# EAGLE design H14RA (EAGLE 9.6.1)

## Sheet 1 of 2
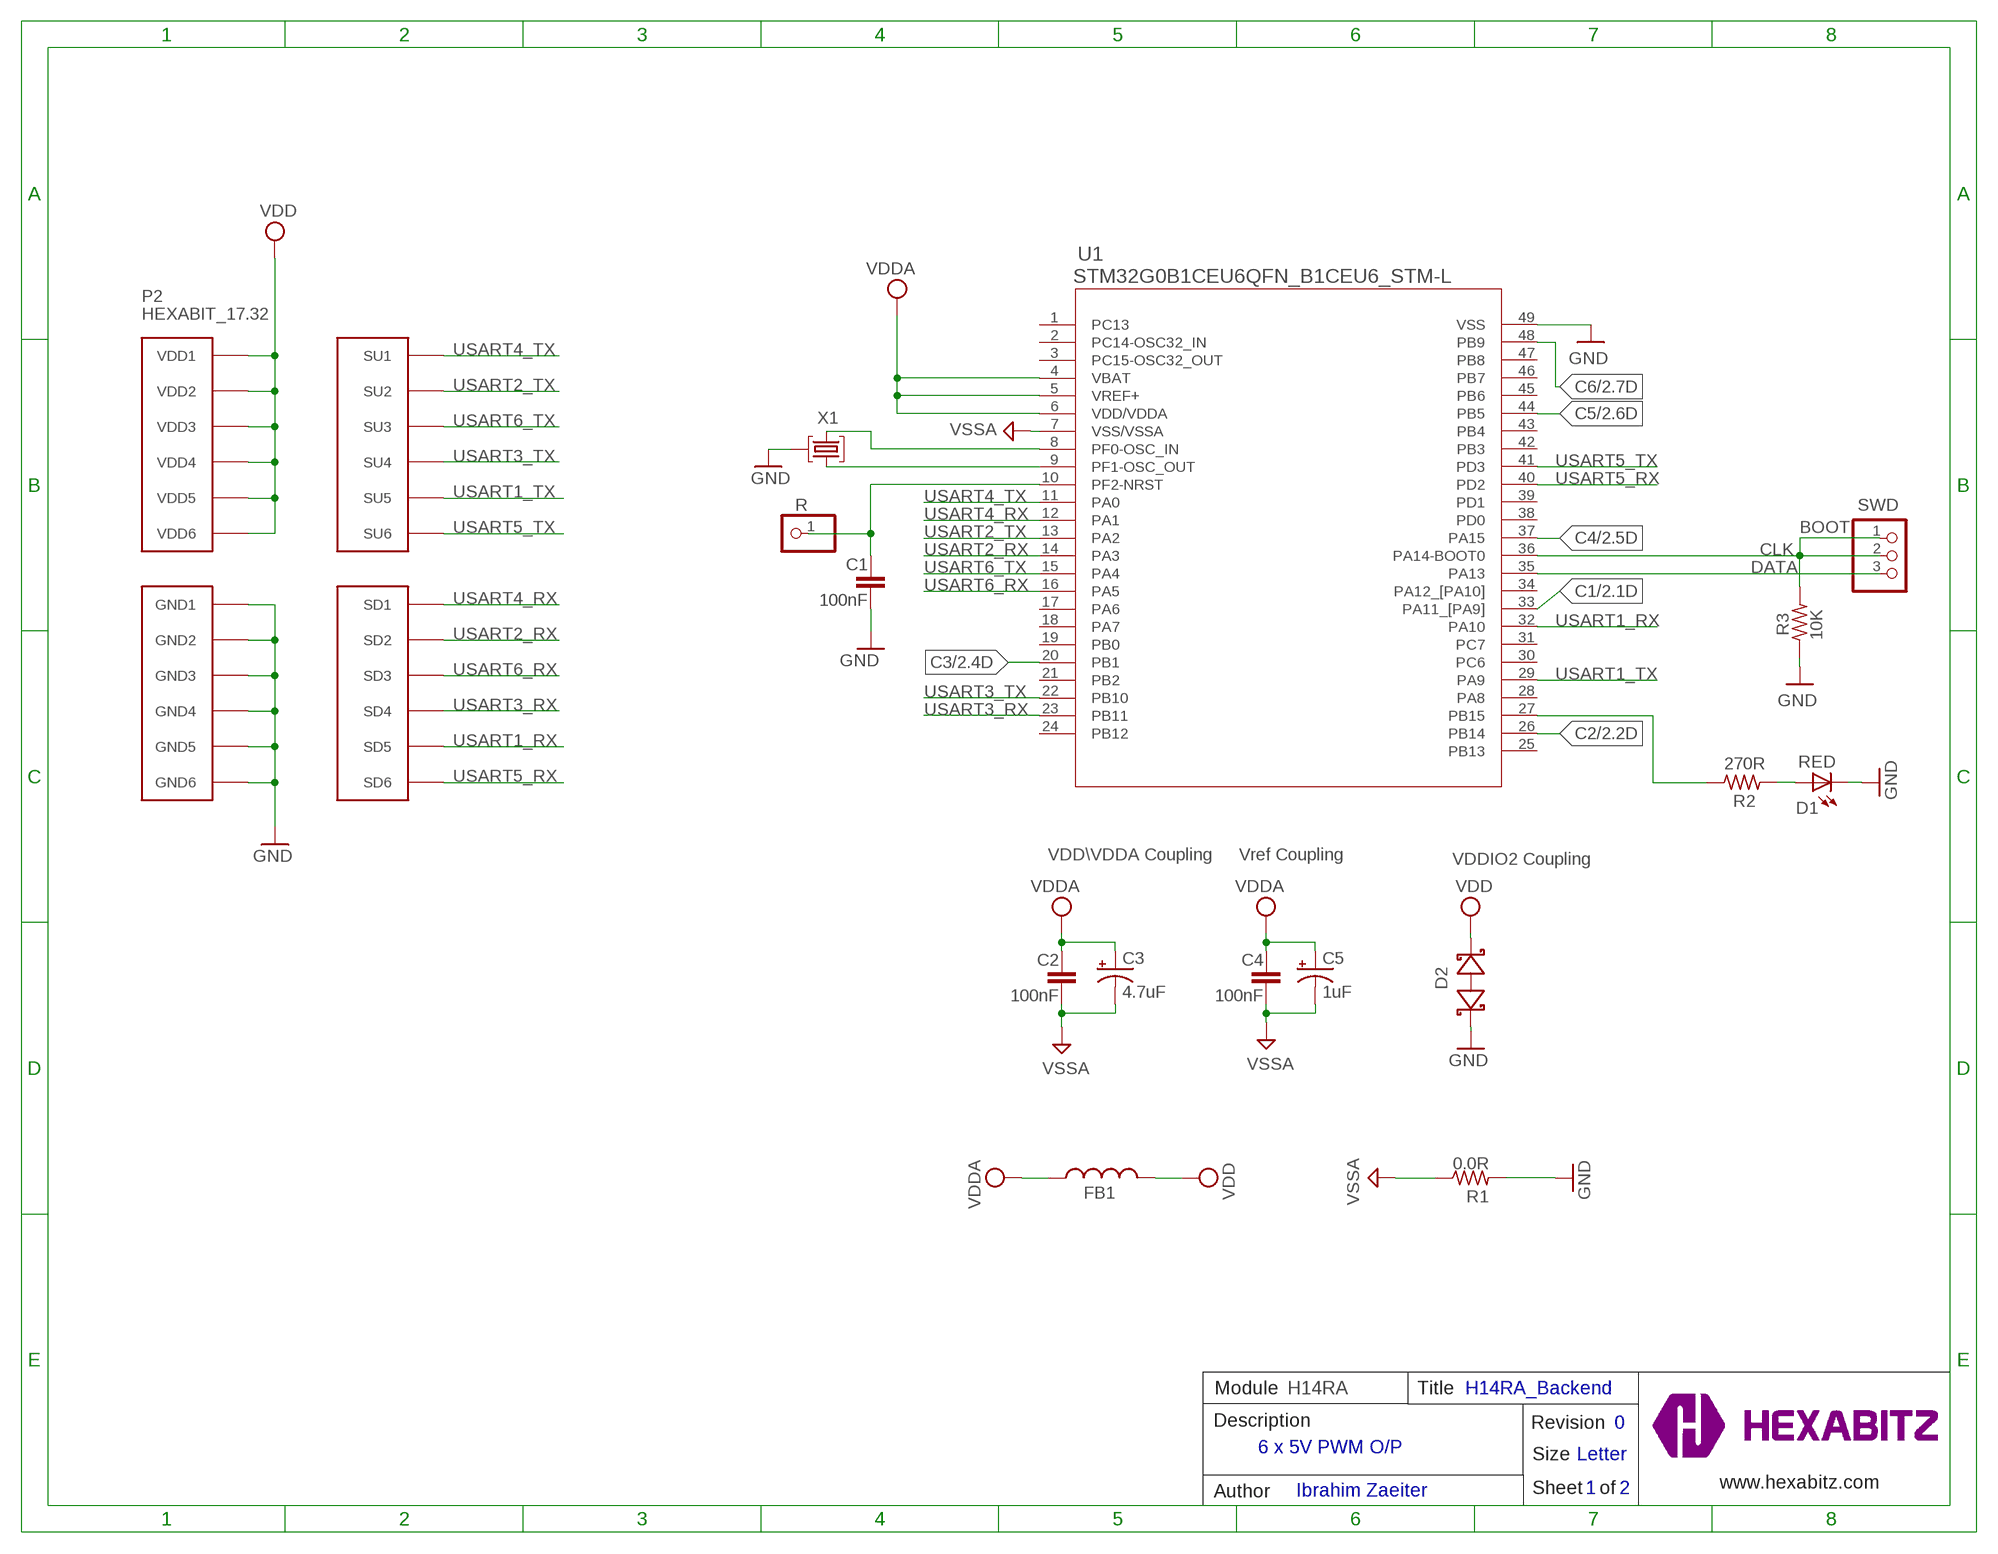
[diagram p0: schematic, sheet 1]

### Parts
C1  100nF  C-0603  [C-0603]
C2  100nF  C-0603  [C-0603]
C3  4.7uF  C-0805-POL  [C-0805-POL]
C4  100nF  C-0603  [C-0603]
C5  1uF  C-0805-POL  [C-0805-POL]
D1  RED  VLMS1300-GS08  [VLMS1300-GS08]
D2  BOURNS_CDSOD323-T03SCBOURNS_CDSOD323-T03SC_0_0  [BOURNS_CDSOD323-T03SC_0]
FB1  FB-0603  [FB-0603]
P2  HEXABIT_17.32  [HEXABIT_17.32]
R  R  PINHD-1X1  [1X01]
R1  0.0R  R-0603  [R-0603]
R2  270R  R-0603  [R-0603]
R3  10K  R-0603  [R-0603]
SWD  PINHD-1X3  [1X03]
TRIMBLE-LOGO2  HEXA-LOGO  [HEXA-LOGO]
U1  STM32G0B1CEU6QFN_B1CEU6_STM-L  [QFN_B1CEU6_STM-L]
X1  XTALL_CSTCE8M00G52  [XTALL_CSTCE8M00G52]

### Nets
C1: U1.33(PA11_[PA9]) ; also sheet 2
C2: U1.26(PB14) ; also sheet 2
C3: U1.20(PB1) ; also sheet 2
C4: U1.37(PA15) ; also sheet 2
C5: U1.44(PB5) ; also sheet 2
C6: U1.48(PB9) ; also sheet 2
CLK: R3.2 SWD.1 SWD.2 U1.36(PA14-BOOT0)
DATA: SWD.3 U1.35(PA13)
GND: C1.2 D1.C D2.1(A) P2.PAD_PD7(GND1) P2.PAD_PD8(GND2) P2.PAD_PD9(GND3) P2.PAD_PD10(GND4) P2.PAD_PD11(GND5) P2.PAD_PD12(GND6) R1.2 R3.1 U1.49(VSS) X1.P$2
N$1: D1.A R2.2
N$2: R2.1 U1.27(PB15)
N$5: U1.9(PF1-OSC_OUT) X1.P$1
N$6: U1.8(PF0-OSC_IN) X1.P$3
N$8: C1.1 R.1 U1.10(PF2-NRST)
USART1_RX: P2.PAD_PD5(SD5) U1.32(PA10)
USART1_TX: P2.PAD_PU5(SU5) U1.29(PA9)
USART2_RX: P2.PAD_PD2(SD2) U1.14(PA3)
USART2_TX: P2.PAD_PU2(SU2) U1.13(PA2)
USART3_RX: P2.PAD_PD4(SD4) U1.23(PB11)
USART3_TX: P2.PAD_PU4(SU4) U1.22(PB10)
USART4_RX: P2.PAD_PD1(SD1) U1.12(PA1)
USART4_TX: P2.PAD_PU1(SU1) U1.11(PA0)
USART5_RX: P2.PAD_PD6(SD6) U1.40(PD2)
USART5_TX: P2.PAD_PU6(SU6) U1.41(PD3)
USART6_RX: P2.PAD_PD3(SD3) U1.16(PA5)
USART6_TX: P2.PAD_PU3(SU3) U1.15(PA4)
VDD: D2.2(C) FB1.2 P2.PAD_PU7(VDD1) P2.PAD_PU8(VDD2) P2.PAD_PU9(VDD3) P2.PAD_PU10(VDD4) P2.PAD_PU11(VDD5) P2.PAD_PU12(VDD6)
VDDA: C2.1 C3.1(+) C4.1 C5.1(+) FB1.1 U1.4(VBAT) U1.5(VREF+) U1.6(VDD/VDDA) ; also sheet 2
VSSA: C2.2 C3.2(-) C4.2 C5.2(-) R1.1 U1.7(VSS/VSSA) ; also sheet 2
Unconnected: U1.1(PC13) U1.2(PC14-OSC32_IN) U1.3(PC15-OSC32_OUT) U1.17(PA6) U1.18(PA7) U1.19(PB0) U1.21(PB2) U1.24(PB12) U1.25(PB13) U1.28(PA8) U1.30(PC6) U1.31(PC7) U1.34(PA12_[PA10]) U1.38(PD0) U1.39(PD1) U1.42(PB3) U1.43(PB4) U1.45(PB6) U1.46(PB7) U1.47(PB8)

### Notes on the sheet
- BOOT
- VDD\VDDA Coupling | Vref Coupling | VDDIO2 Coupling
- Module | H14RA | Title | H14RA_Backend
- Description | Revision | 0
- 6 x 5V PWM O/P
- Size | Letter
- www.hexabitz.com
- Author | Ibrahim Zaeiter | Sheet   of | 1 | 2
- C:/Users/Admin/Desktop/logodraft.bmp

## Sheet 2 of 2
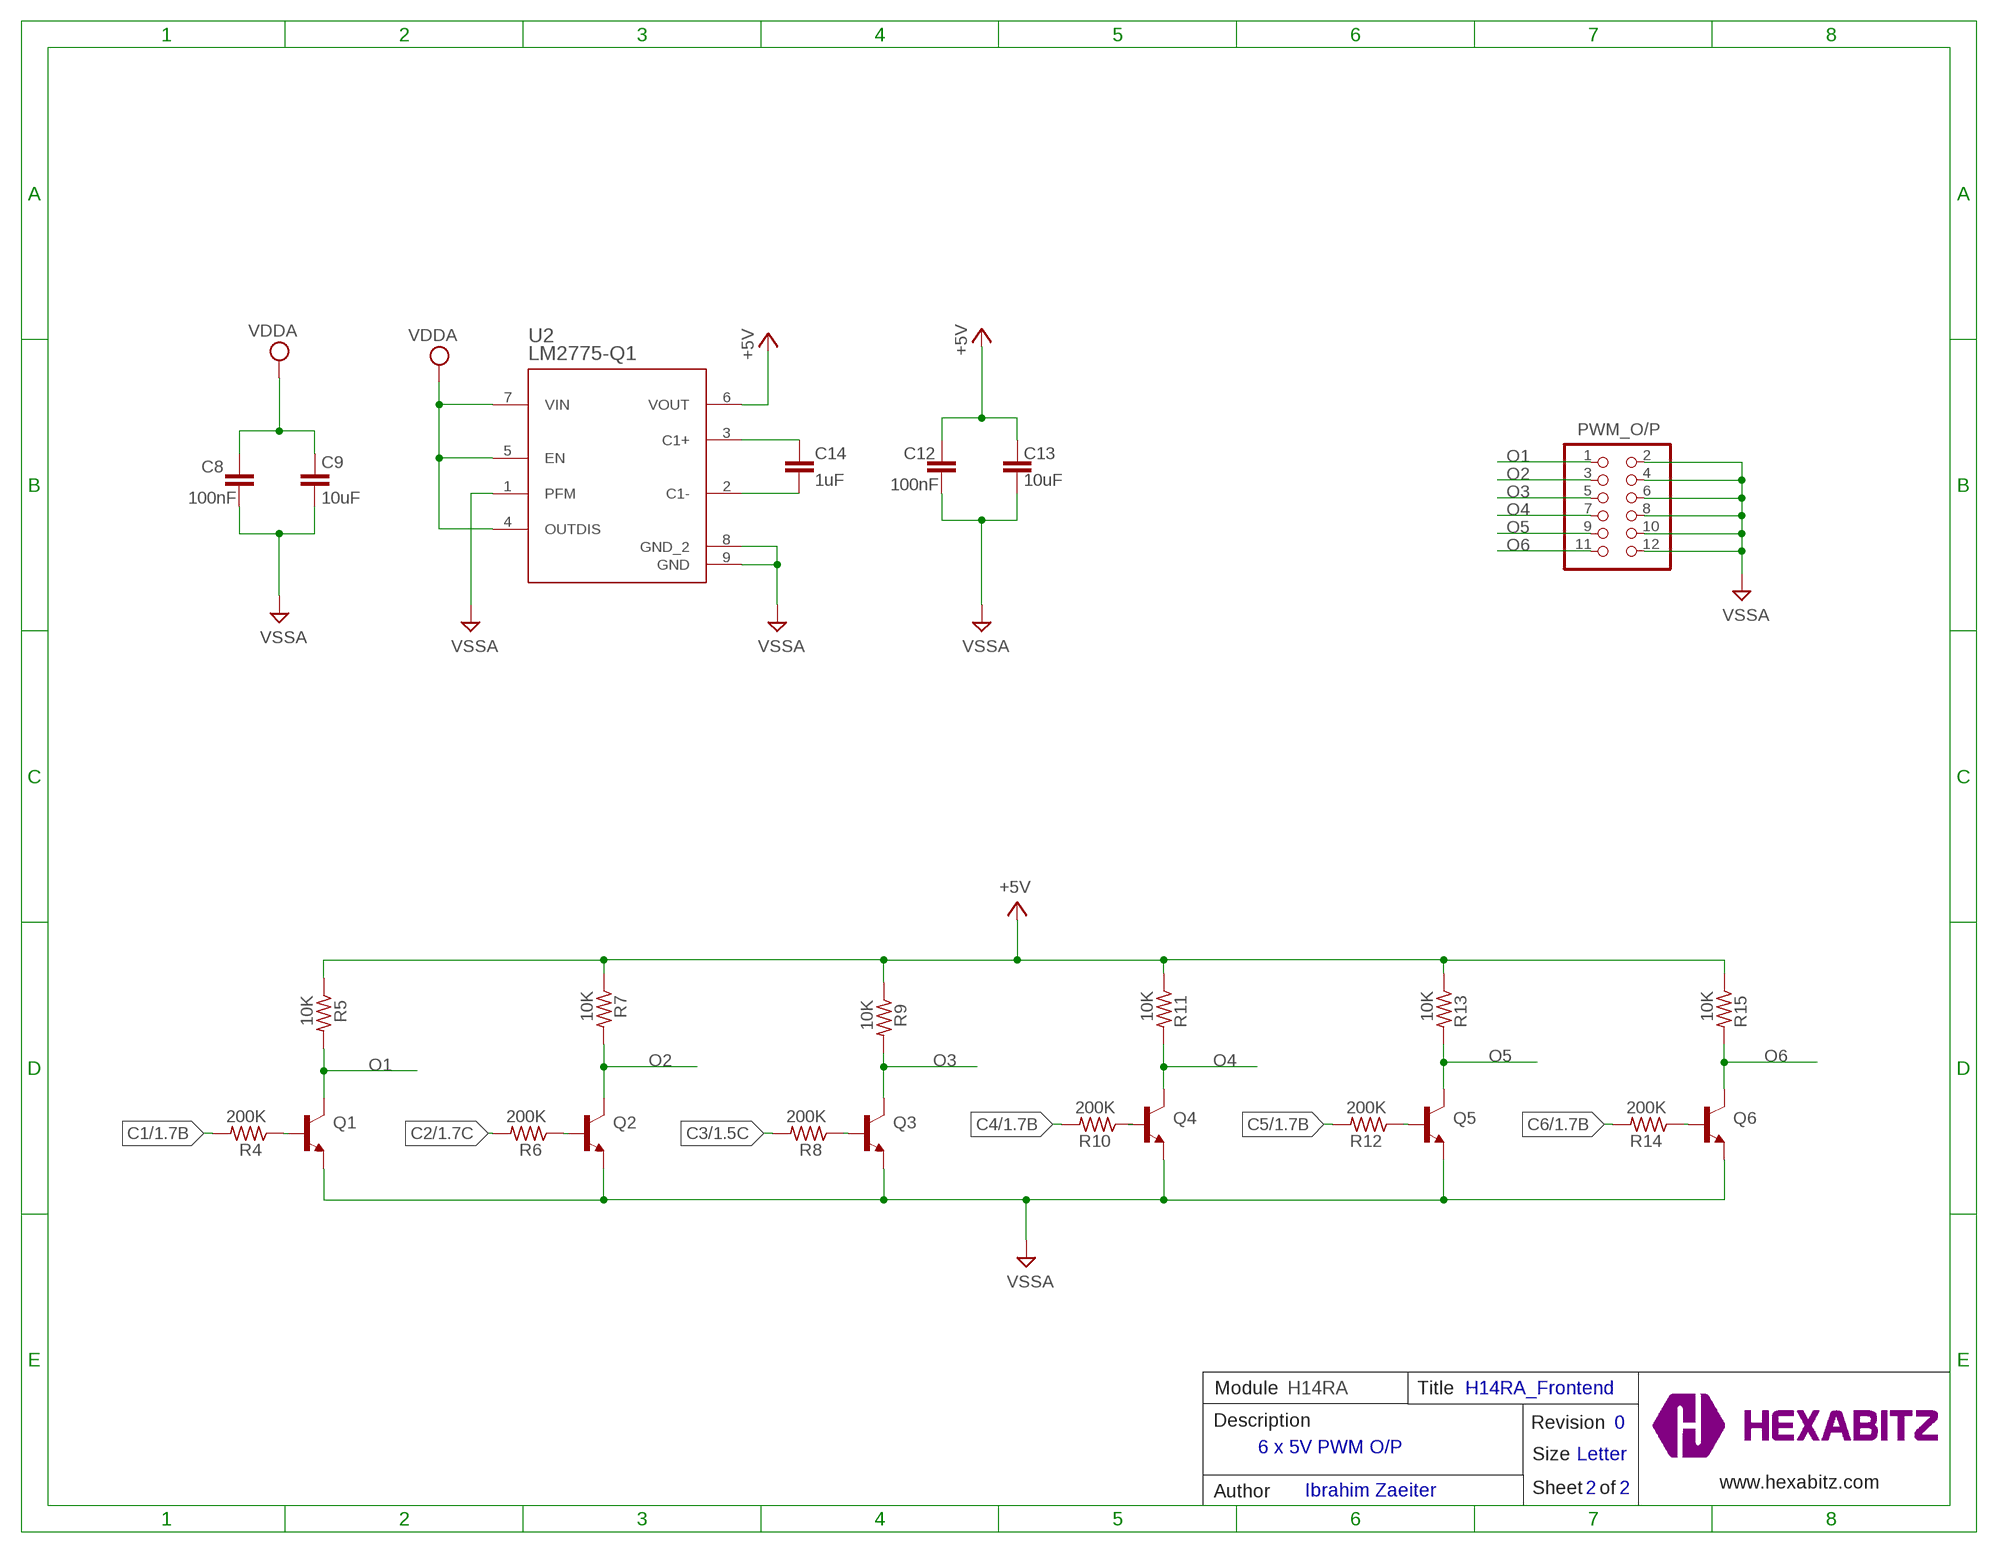
[diagram p1: schematic, sheet 2]

### Parts
C8  100nF  C-0603  [C-0603]
C9  10uF  C-0603  [C-0603]
C12  100nF  C-0603  [C-0603]
C13  10uF  C-0603  [C-0603]
C14  1uF  C-0805  [C-0805]
PWM_O/P  PINHD-2X6  [2X06]
Q1  MMBT3904LT1  [MMBT3904LT1]
Q2  MMBT3904LT1  [MMBT3904LT1]
Q3  MMBT3904LT1  [MMBT3904LT1]
Q4  MMBT3904LT1  [MMBT3904LT1]
Q5  MMBT3904LT1  [MMBT3904LT1]
Q6  MMBT3904LT1  [MMBT3904LT1]
R4  200K  R-0603  [R-0603]
R5  10K  R-0603  [R-0603]
R6  200K  R-0603  [R-0603]
R7  10K  R-0603  [R-0603]
R8  200K  R-0603  [R-0603]
R9  10K  R-0603  [R-0603]
R10  200K  R-0603  [R-0603]
R11  10K  R-0603  [R-0603]
R12  200K  R-0603  [R-0603]
R13  10K  R-0603  [R-0603]
R14  200K  R-0603  [R-0603]
R15  10K  R-0603  [R-0603]
U2  LM2775-Q1  LM2775QDSGRQ1  [DSG0008A]

### Nets
+5V: C12.1 C13.1 R5.1 R7.1 R9.1 R11.1 R13.1 R15.1 U2.6(VOUT)
C1: R4.2 ; also sheet 1
C2: R6.2 ; also sheet 1
C3: R8.2 ; also sheet 1
C4: R10.2 ; also sheet 1
C5: R12.2 ; also sheet 1
C6: R14.2 ; also sheet 1
N$3: C14.2 U2.2(C1-)
N$4: C14.1 U2.3(C1+)
N$12: Q5.1(B) R12.1
N$14: Q4.1(B) R10.1
N$15: Q6.1(B) R14.1
N$16: Q2.1(B) R6.1
N$18: Q1.1(B) R4.1
N$20: Q3.1(B) R8.1
O1: PWM_O/P.1 Q1.3(C) R5.2
O2: PWM_O/P.3 Q2.3(C) R7.2
O3: PWM_O/P.5 Q3.3(C) R9.2
O4: PWM_O/P.7 Q4.3(C) R11.2
O5: PWM_O/P.9 Q5.3(C) R13.2
O6: PWM_O/P.11 Q6.3(C) R15.2
VDDA: C8.1 C9.1 U2.4(OUTDIS) U2.5(EN) U2.7(VIN) ; also sheet 1
VSSA: C8.2 C9.2 C12.2 C13.2 PWM_O/P.2 PWM_O/P.4 PWM_O/P.6 PWM_O/P.8 PWM_O/P.10 PWM_O/P.12 Q1.2(E) Q2.2(E) Q3.2(E) Q4.2(E) Q5.2(E) Q6.2(E) U2.1(PFM) U2.8(GND_2) U2.9(GND) ; also sheet 1

### Notes on the sheet
- Module | H14RA | Title | H14RA_Frontend
- Description | Revision | 0
- 6 x 5V PWM O/P
- Size | Letter
- www.hexabitz.com
- Author | Ibrahim Zaeiter | Sheet   of | 2 | 2
- C:/Users/Admin/Desktop/logodraft.bmp

## Library data of the parts
C1 C2 C4 C8 C9 C12 C13 = HEXABITZ_RCLS:C-0603: CAP CER 10% X7R 0603
C3 C5 = HEXABITZ_RCLS:C-0805-POL: Cap Tant Solid SMD 2012
C14 = HEXABITZ_RCLS:C-0805: CAP CER 10% X7R 0805
D1 = Hexabitz:VLMS1300-GS08: Red 0603 130° Clear 54 mcd 2 V Surface Mount ChipLED ; Octopart Url : http://octopart.com/vlms1300-gs08-vishay-21709201; MFN: Vishay; MPN: VLMS1300-GS08; OCTOPART_URL: https://octopart.com/vlms1300-gs08-vishay-21709201?r=sp&s=_gcP4_q8T1SC6PJQPTQ9yA
D2 = HEXABITZ_RCLS:BOURNS_CDSOD323-T03SC: CDSOD323-TxxSC - TVS Diode Series; DESCRIPTION: Dio Tvs Vwm 03V 500W Bidir Sod323 / Tape & Reel - 7" Reel; MFN: Bourns; MPN: CDSOD323-T03SC; OCTOPART_URL: https://octopart.com/cdsod323-t03sc-bourns-10487153?r=sp
FB1 = HEXABITZ_RCLS:FB-0603: Ferrite Beads Multi-Layer 0603
P2 = hexabitz_connectors:HEXABIT_?: Hexabitz Hexagon Module Connector Hexagon side length = 28.87mm.
PWM_O/P = pinhead:PINHD-2X6: PIN HEADER
Q1-Q6 = HEXABITZ_RCLS:MMBT3904LT1: TRANS NPN 40V 0.2A SOT23; MOUNTING_STYLE: Surface Mount; NUM_OF_PINS: 3; PACKAGE: SOT-23-3; PACKAGING: Reel; PRODUCT_CATEGORY: Transistors Bipolar-BJT; SERIES: MMBT3904L
R = HEXABITZ_USER_INTERFACE_PARTS:PINHD-1X1: PIN HEADER; MFN: TE Connectivity; MPN: 87227-1; OCTOPART_URL: https://octopart.com/87227-1-te+connectivity-39512052?r=sp
R1-R15 = HEXABITZ_RCLS:R-0603: Thick Film Resistors - SMD 0603
SWD = pinhead:PINHD-1X3: PIN HEADER
TRIMBLE-LOGO2 = HEXABITZ_USER_INTERFACE_PARTS:HEXA-LOGO: Trimble-Logo
U1 = HEXABITZ_ICs:STM32G0B1CEU6; COPYRIGHT: Copyright (C) 2021 Ultra Librarian. All rights reserved.; MANUFACTURER_PART_NUMBER: STM32G0B1CEU6; MFR_NAME: STMicroelectronics
U2 = HEXABITZ_ICs:LM2775QDSGRQ1: Switched Capacitor 5V Boost Converter 8-WSON -40 to 125; MANUFACTURER: Texas Instruments; MFN: Texas Instruments; MPN: LM2775QDSGRQ1; OCTOPART_URL: https://octopart.com/lm2775qdsgrq1-texas+instruments-93339195?r=sp&s=OA7oim0HQqaBsU4tLKFWXg LM2775QDSGRQ1; PARTNUMBER: LM2775QDSGRQ1; REFDES: RefDes; TYPE: TYPE
X1 = Hexabitz:XTALL_CSTCE8M00G52: MURATA CSTCE8M00G52-R0 RESONATOR, SMD, 8MHZ ; Octopart Url : https://octopart.com/cstce8m00g52-r0-murata-7145559; MFN: Murata; MPN: CSTCE8M00G52Z-R0; OCTOPART_URL: https://octopart.com/cstce8m00g52z-r0-murata-17755941?r=sp&s=JDnNJnrHQhyS8Zk4ofFWXw

## Board
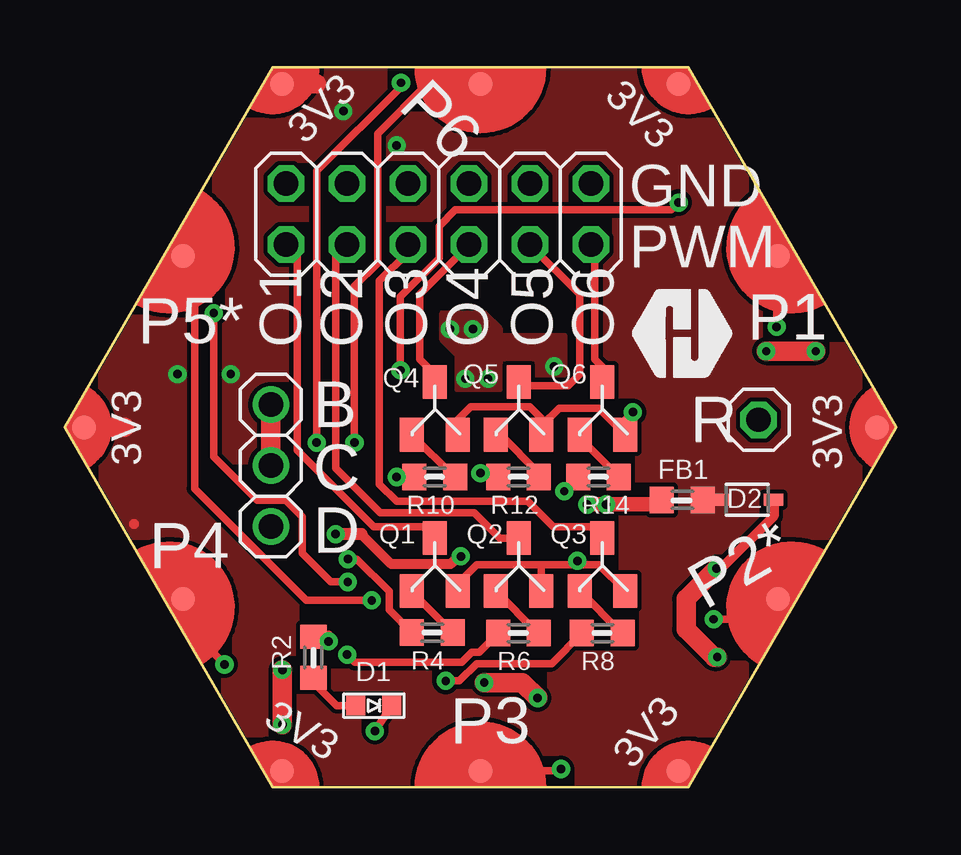
[diagram p2: board, top side]
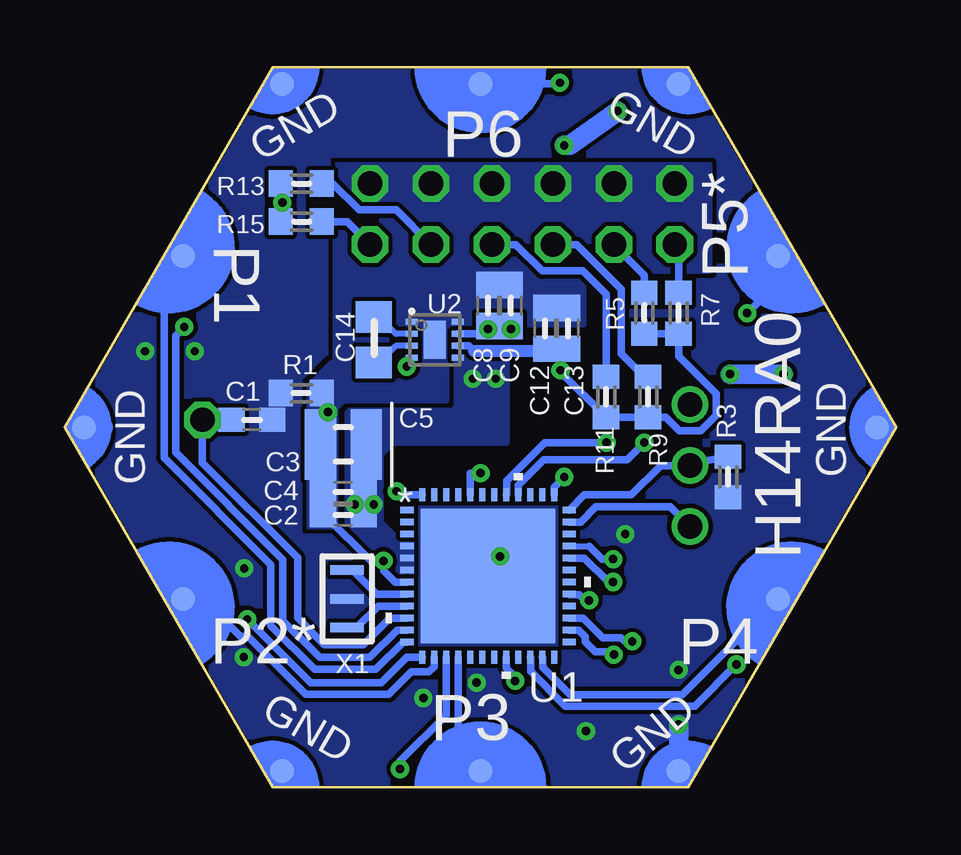
[diagram p3: board, bottom side, seen from below]

Size 34.64 x 30 mm. Coordinates in mm from the lower left corner, seen from the top.
Copper layers (1*16): Top 0.035mm / dielectric 1.5mm / Bottom 0.035mm
Design rules "default *": minimum track width 6mil, minimum drill 0.35mm, track to track 7mil, track to pad 7mil, pad to pad 7mil, via to via 7mil, smd to smd 0mil, copper to edge 1mil, drill to drill 6mil, minimum pad ring 10mil, minimum via ring 8mil, stop-mask expansion 4mil, vias tented up to drill 24mil, thermal gap 10mil

### Footprints (pad centres in the part's own frame; a part is rotated, then mirrored left to right if it is on the bottom)
C-0603 = smd 1.1 x 1: 1 -0.85,0; 2 0.85,0
C-0805-POL = smd 1.3 x 1.5: 1 -0.95,0; 2 0.95,0
C-0805 = smd 1.3 x 1.5: 1 -0.95,0; 2 0.95,0
VLMS1300-GS08 = smd 0.8 x 0.8: A 0,0.75; C 0,-0.75
BOURNS_CDSOD323-T03SC_0 = smd 0.8 x 0.5: 1 -1.1,0; 2 1.1,0
FB-0603 = smd 1 x 1.1: 1 -0.85,0; 2 0.85,0
HEXABIT_17.32 = smd 1 x 1 bottom: PAD_PD1 12.39,7.15; PAD_PD2 12.39,-7.15; PAD_PD3 0,-14.31; PAD_PD4 -12.39,-7.15; PAD_PD5 -12.39,7.15; PAD_PD6 0,14.31; PAD_PD7 8.26,14.31; PAD_PD8 16.52,0; PAD_PD9 8.26,-14.31; PAD_PD10 -8.26,-14.31; PAD_PD11 -16.52,0; PAD_PD12 -8.26,14.31 | smd 1 x 1: PAD_PU1 12.39,7.15; PAD_PU2 12.39,-7.15; PAD_PU3 0,-14.31; PAD_PU4 -12.39,-7.15; PAD_PU5 -12.39,7.15; PAD_PU6 0,14.31; PAD_PU7 8.26,14.31; PAD_PU8 16.52,0; PAD_PU9 8.26,-14.31; PAD_PU10 -8.26,-14.31; PAD_PU11 -16.52,0; PAD_PU12 -8.26,14.31
2X06 = drill 1.016 octagon: 1 -6.35,-1.27; 2 -6.35,1.27; 3 -3.81,-1.27; 4 -3.81,1.27; 5 -1.27,-1.27; 6 -1.27,1.27; 7 1.27,-1.27; 8 1.27,1.27; 9 3.81,-1.27; 10 3.81,1.27; 11 6.35,-1.27; 12 6.35,1.27
MMBT3904LT1 = smd 1 x 1.4: 1 -0.95,-1.1; 2 0.95,-1.1; 3 0,1.1
1X01 = drill 1.016 octagon: 1 0,0
R-0603 = smd 1 x 1.1: 1 -0.85,0; 2 0.85,0
1X03 = drill 1.016: 1 -2.54,0; 2 0,0; 3 2.54,0
QFN_B1CEU6_STM-L = smd 0.55 x 0.254: 1 -3.38,2.751; 2 -3.38,2.251; 3 -3.38,1.75; 4 -3.38,1.25; 5 -3.38,0.75; 6 -3.38,0.25; 7 -3.38,-0.25; 8 -3.38,-0.75; 9 -3.38,-1.25; 10 -3.38,-1.75; 11 -3.38,-2.251; 12 -3.38,-2.751; 25 3.38,-2.751; 26 3.38,-2.251; 27 3.38,-1.75; 28 3.38,-1.25; 29 3.38,-0.75; 30 3.38,-0.25; 31 3.38,0.25; 32 3.38,0.75; 33 3.38,1.25; 34 3.38,1.75; 35 3.38,2.251; 36 3.38,2.751 | smd 0.254 x 0.55: 13 -2.751,-3.38; 14 -2.251,-3.38; 15 -1.75,-3.38; 16 -1.25,-3.38; 17 -0.75,-3.38; 18 -0.25,-3.38; 19 0.25,-3.38; 20 0.75,-3.38; 21 1.25,-3.38; 22 1.75,-3.38; 23 2.251,-3.38; 24 2.751,-3.38; 37 2.751,3.38; 38 2.251,3.38; 39 1.75,3.38; 40 1.25,3.38; 41 0.75,3.38; 42 0.25,3.38; 43 -0.25,3.38; 44 -0.75,3.38; 45 -1.25,3.38; 46 -1.75,3.38; 47 -2.251,3.38; 48 -2.751,3.38 | smd 5.6 x 5.6: 49 0,0
DSG0008A = smd 0.5 x 0.25: 1 -0.95,0.75; 2 -0.95,0.25; 3 -0.95,-0.25; 4 -0.95,-0.75; 5 0.95,-0.75; 6 0.95,-0.25; 7 0.95,0.25; 8 0.95,0.75 | smd 0.9 x 1.6: 9 0,0
XTALL_CSTCE8M00G52 = smd 1.4 x 0.4: P$1 0,1.2; P$2 0,0; P$3 0,-1.2

### Placement (x,y rotation side)
C1  26.84,15.32 0 bottom
C2  23.04,11.35 180 bottom
C3  23.04,13.57 180 bottom
C4  23.04,12.3 180 bottom
C5  23.04,15 180 bottom
C8  17,20.08 90 bottom
C9  16.05,20.08 90 bottom
C12  14.62,19.13 90 bottom
C13  13.67,19.13 90 bottom
C14  21.77,18.65 90 bottom
D1  12.88,3.41 90 top
D2  28.43,11.98 180 top
FB1  25.73,11.98 0 top
P2  17.32,15 0 top
PWM_O/P  15.57,23.89 0 top
Q1  15.42,9.29 0 top
Q2  18.91,9.29 0 top
Q3  22.4,9.29 0 top
Q4  15.42,15.79 0 top
Q5  18.91,15.79 0 top
Q6  22.4,15.79 0 top
R  28.91,15.32 90 top
R1  24.78,16.43 180 bottom
R2  10.36,5.42 270 top
R3  7,12.94 90 bottom
R4  15.31,6.45 180 top
R5  9.06,19.76 90 bottom
R6  18.91,6.43 180 top
R7  10.49,19.76 90 bottom
R8  22.4,6.43 180 top
R9  10.34,16.27 90 bottom
R10  15.42,12.94 180 top
R11  12.08,16.27 90 bottom
R12  18.91,12.94 180 top
R13  24.78,25.16 0 bottom
R14  22.24,12.94 180 top
R15  24.78,23.57 0 bottom
SWD  8.59,13.41 270 top
TRIMBLE-LOGO2  25.73,17.06 0 top
U1  17,8.81 0 bottom
U2  19.23,18.65 0 bottom
X1  22.88,7.86 180 bottom

### Tracks (layer width: path | path; a pad name or v marks a point on that pad's centre or on a via)
+5V  (via drill 0.35)
  Top 0.305: v13.99,17.38 13.99,20.44 15.59,22.05 15.59,23.39 16.27,24.07 25.28,24.07 v25.58,24.37
  Bottom 0.254: C12.1 14.14,18.28 C13.1
  Bottom 0.305: R13.1 25.58,25.1 v25.58,24.37 25.63,24.31 R15.1 | R7.1 R5.1 9.06,17.97 7.5,16.4 7.5,15.5 8.14,14.86 9.04,14.86 9.6,15.42 R9.1 R11.1 13.99,17.32 v13.99,17.38 13.99,18.12 14.14,18.28 | U2.6 17.8,18.4 17.59,18.19 | C12.1 14.71,18.19
  Bottom 0.508: 17.59,18.19 14.71,18.19
C1  (via drill 0.35)
  Top 0.305: v11.79,9.51 12.17,9.51 13.51,8.17 13.51,7.4 R4.2
  Bottom 0.254: U1.33 12.79,10.06
  Bottom 0.305: v11.79,9.51 12.24,9.51 12.79,10.06
C2  (via drill 0.35)
  Top 0.305: v11.76,5.53 12.08,5.21 16.54,5.21 16.96,5.64 17.27,5.64 R6.2
  Bottom 0.305: v11.76,5.53 11.89,5.66 12.54,5.66 12.96,6.08 12.96,6.28 13.23,6.56 U1.26
C3  (via drill 0.35)
  Top 0.305: v15.88,4.44 16.44,4.44 17.16,5.16 20.28,5.16 R8.2
  Bottom 0.305: U1.20 16.25,4.97 15.88,4.6 v15.88,4.44
C4  (via drill 0.35)
  Top 0.305: v13.83,12.94 R10.2
  Bottom 0.305: U1.37 14.25,12.51 v13.83,12.94
C5  (via drill 0.35)
  Top 0.305: v17.32,13.09 17.9,13.09 R12.2
  Bottom 0.305: v17.32,13.09 17.75,13.09 U1.44
C6  (via drill 0.35)
  Top 0.305: v20.81,12.34 20.81,12.36 R14.2
  Bottom 0.305: v20.81,12.34 20.66,12.19 U1.48
CLK
  Top 0.813: SWD.1 SWD.2
  Bottom 0.305: U1.36 12.99,12.19 11.03,12.19 9.81,13.41 SWD.2 8.49,13.51 R3.2
DATA
  Bottom 0.305: SWD.3 9.41,11.69 12.51,11.69 13.15,11.06 U1.35
GND  (via drill 0.35, 0.35 pad 0.75)
  Top 0.305: D1.C 13.67,3.46 v12.92,2.35
  Top 0.406: D2.1 29.53,11.3 27.35,9.13 v27.16,9.13 | v16.5,9.63 16.4,9.63 16.07,9.3 13.61,9.3 12.36,10.55
  Top 0.508: 12.36,10.55 v11.29,10.55
  Top 0.813: v19.7,3.73 19.07,4.36 v17.48,4.36 | v9.06,4.9 v9.06,2.62 | v27.16,9.13 25.89,7.86 25.89,6.59 27.05,5.43 v27.18,5.43 | v29.23,18.17 v31.29,18.17
  Bottom 0.406: U1.49 16.5,9.31 v16.5,9.63
  Bottom 0.813: 33.67,15.72 33.84,15.42 P2.PAD_PD8 33.04,15 | v9.06,2.62 P2.PAD_PD10 | 0.8,14.58 P2.PAD_PD11 0.8,15.42
  pour Bottom (rank 3, no thermals): 0.02,15 8.59,29.92 25.73,29.92 34.62,15.32 26.05,0.08 8.75,0.08
N$1
  Top 0.305: R2.2 10.36,4.38 11.33,3.41 D1.A
N$2  (via drill 0.35)
  Top 0.305: R2.1 11,6.38 v11,6.08
  Bottom 0.305: v11,6.08 11.32,6.08 11.47,6.24 12.23,6.24 13.03,7.04 13.61,7.04 U1.27
N$3
  Bottom 0.152: C14.2 21.66,19.5 21.45,19.5
  Bottom 0.254: U2.2 20.85,18.9 21.45,19.5
N$4
  Bottom 0.152: C14.1 21.55,17.7 21.45,17.8
  Bottom 0.254: U2.3 20.85,18.4 21.45,17.8
N$5
  Bottom 0.305: U1.9 21.59,7.56 22.49,6.66 X1.P$1
N$6
  Bottom 0.305: U1.8 21.65,8.06 22.65,9.06 X1.P$3
N$8
  Bottom 0.305: U1.10 21.11,7.06 22.21,5.95 23.83,5.95 24.94,7.06 24.94,9.57 28.91,13.54 R.1 C1.1
N$12
  Top 0.305: Q5.1 18.16,14.69 19.76,13.09 R12.1
N$14
  Top 0.305: Q4.1 16.22,12.94 R10.1
N$15
  Top 0.305: Q6.1 21.45,14.58 R14.1
N$16
  Top 0.305: R6.1 19.71,6.43 Q2.1
N$18
  Top 0.305: R4.1 14.46,8.15 Q1.1
N$20
  Top 0.305: R8.1 23.21,6.43 Q3.1
O1
  Top 0.305: Q1.3 14.94,10.86 12.88,10.86 9.68,14.06 9.68,22.16 PWM_O/P.1
  Bottom 0.305: R5.2 9.06,22.46 PWM_O/P.1
O2
  Top 0.305: Q2.3 18.11,10.38 17.06,11.43 13.15,11.43 11.29,13.3 11.29,22.14 PWM_O/P.3
  Bottom 0.305: PWM_O/P.3 10.49,21.35 R7.2
O3
  Top 0.305: Q3.3 21.92,10.86 20.35,10.86 19.29,11.92 13.83,11.92 13.1,12.64 13.1,21.1 14.3,22.3 PWM_O/P.5
  Bottom 0.305: R9.2 10.49,17.12 11.45,18.07 11.45,20.76 13.31,22.62 PWM_O/P.5
O4
  Top 0.305: Q4.3 15.42,17.21 14.78,17.85 14.78,20.56 PWM_O/P.7
  Bottom 0.305: R11.2 12.08,20.56 13.05,21.53 14.76,21.53 15.85,22.62 PWM_O/P.7
O5
  Top 0.305: Q5.3 19.07,16.73 20.97,16.73 21.45,17.21 21.45,20.56 PWM_O/P.9
  Bottom 0.305: R13.2 23.47,25.16 22.38,24.07 20.83,24.07 PWM_O/P.9
O6
  Top 0.305: Q6.3 22.4,17.53 22.08,17.85 22.08,22.46 PWM_O/P.11
  Bottom 0.305: R15.2 22.88,23.57 PWM_O/P.11
USART1_RX  (via drill 0.35)
  Top 0.305: v6.21,19.76 6.21,13.77 8.02,11.96 9.2,11.96 9.89,11.28 9.89,9.75 11.08,8.56 v11.79,8.56
  Bottom 0.305: v11.79,8.56 11.79,8.61 12.04,8.61 12.99,9.56 U1.32 | v6.21,19.76 4.93,21.04 P2.PAD_PD5
USART1_TX  (via drill 0.35)
  Top 0.305: P2.PAD_PU5 5.41,21.67 5.41,12.45 10.06,7.79 v12.79,7.79
  Bottom 0.305: U1.29 13.6,8.04 13.21,8.04 12.96,7.79 v12.79,7.79
USART2_RX
  Bottom 0.305: P2.PAD_PD2 28.88,7.85 27.33,6.3 27.01,6.3 24.6,3.88 21.14,3.88 20.19,4.82 19.47,4.82 19.25,5.04 U1.14
USART2_TX  (via drill 0.35)
  Top 0.305: P2.PAD_PU2 28.87,7.01 v27.04,7.01
  Bottom 0.305: v27.04,7.01 24.4,4.36 21.45,4.36 20.38,5.43 U1.13
USART3_RX
  Bottom 0.305: U1.23 14.73,5.41 14.73,5.02 13.59,3.87 8.91,3.87 P2.PAD_PD4
USART3_TX  (via drill 0.35)
  Top 0.305: v6.66,5.12 5.02,6.75 4.93,6.92 P2.PAD_PU4
  Bottom 0.305: v6.66,5.12 8.39,3.39 13.79,3.39 15.23,4.84 15.23,5.41 U1.22
USART4_RX
  Bottom 0.305: U1.12 20.54,6.06 21.68,4.92 24.23,4.92 26.05,6.74 26.05,9.28 30.5,13.74 30.5,21.36 P2.PAD_PD1
USART4_TX  (via drill 0.35)
  Top 0.305: P2.PAD_PU1 29.71,20.03 29.66,19.98 v29.66,19.19
  Bottom 0.305: v29.66,19.19 30.02,18.83 30.02,13.96 25.55,9.49 25.55,6.95 24.02,5.42 21.93,5.42 20.79,6.56 U1.11
USART5_RX  (via drill 0.35)
  Top 0.305: v10.49,14.36 10.49,25.69 14.01,29.2 v14.01,29.36
  Bottom 0.305: U1.40 15.75,12.58 14.69,13.64 11.21,13.64 v10.49,14.36 | P2.PAD_PD6 14.06,29.31 v14.01,29.36
USART5_TX  (via drill 0.35)
  Top 0.305: v12.07,14.36 12.07,20.87 13.03,21.84 13.03,27.25 15.1,29.31 P2.PAD_PU6
  Bottom 0.305: U1.41 16.23,12.21 16.23,12.78 14.65,14.36 v12.07,14.36
USART6_RX
  Bottom 0.305: U1.16 18.25,2.05 17.59,1.38 17.59,0.96 P2.PAD_PD3
USART6_TX  (via drill 0.35)
  Top 0.305: v20.68,0.77 20.6,0.69 P2.PAD_PU3
  Bottom 0.305: U1.15 18.75,3.01 20.68,1.09 v20.68,0.77
VDD  (via drill 0.35)
  Top 0.406: D2.2 FB1.2 | 2.88,10.98
  Top 0.813: 25.82,0.69 | 33.84,14.69 P2.PAD_PU8 33.84,15.42 | P2.PAD_PU12 10.47,29.31 | 8.49,1.26 P2.PAD_PU10 | 2.47,15 P2.PAD_PU11
  Bottom 0.813: v11.61,28.18 13.61,26.75 v13.83,26.75 | v6.92,17.22 v4.7,17.22
  pour Top (rank 2, no thermals): 0.02,15 8.59,29.92 25.73,29.92 34.62,15.32 26.05,0.08 8.75,0.08
VDDA  (via drill 0.35)
  Top 0.61: FB1.1 24.69,11.79 v22.56,11.79 v21.77,11.79
  Bottom 0.254: U2.4 20.39,17.68 v20.39,17.54
  Bottom 0.305: C9.1 16.19,19.09 v17,19.09 | U2.7 17.2,18.9 v17,19.09 | C8.1 v17,19.09
  other vias: 16.05,19.09 16.68,17.03 17.64,17.03
  pour Bottom (rank 2, no thermals): 16.21,18.02 18.43,18.02 18.43,15.79 22.72,15.79 22.88,15.63 22.88,10.87 20.97,8.97 20.18,8.97 20.18,10.24 20.65,10.24 21.45,11.03 21.45,13.89 20.97,14.36 16.21,14.36
  pour Top (no thermals): 18.11,16.59 16.37,16.59 16.37,18.02 15.73,18.65 15.73,19.76 17.48,19.76 18.11,19.13 18.11,18.81 20.81,18.81 20.81,17.06 19.7,17.06 19.7,17.86 18.11,17.86
VSSA  (via drill 0.35)
  Top 0.305: Q1.2 16.37,8.49 17.16,9.28 19.86,9.28 | Q3.2 22.25,9.28 21.45,9.28 | 19.86,9.28 21.45,9.28 | Q2.2 19.86,9.28 | 21.45,9.28 21.36,9.37 v21.36,9.44 | Q4.2 16.37,15.31 16.91,15.86 19.38,15.86 19.86,15.39 Q5.2 19.86,15.07 20.59,15.8 22.24,15.8 Q6.2 23.35,15.31 v23.67,15.63
  Bottom 0.305: U1.7 20.88,8.56 21.36,9.04 v21.36,9.44 21.89,9.44 23.8,11.35 C2.2
  pour Bottom (no thermals): 7.79,25.95 7.79,21.51 13.03,21.51 13.03,19.29 18.75,19.29 18.75,16.11 23.35,16.11 23.35,25.95
  pour Bottom (no thermals): 24.46,10.87 23.35,10.87 23.35,15.79 22.72,16.43 21.61,16.43 21.61,17.7 23.51,17.7 24.46,16.75

### Text on the board
tPlace: 3V3 | 3V3 | GND | PWM | P5* | P1 | O1 | O2 | O3 | O4 | O5 | O6 | 3V3 | R | 3V3 | C | D | P4 | P2* | 3V3 | P3 | 3V3
bPlace: H14RA0
tNames: P6 | B
bNames: GND | GND | P5* | P6 | P1 | GND | GND | P4 | P2* | GND | P3 | GND